# EAGLE design sd_card (EAGLE 5.12)
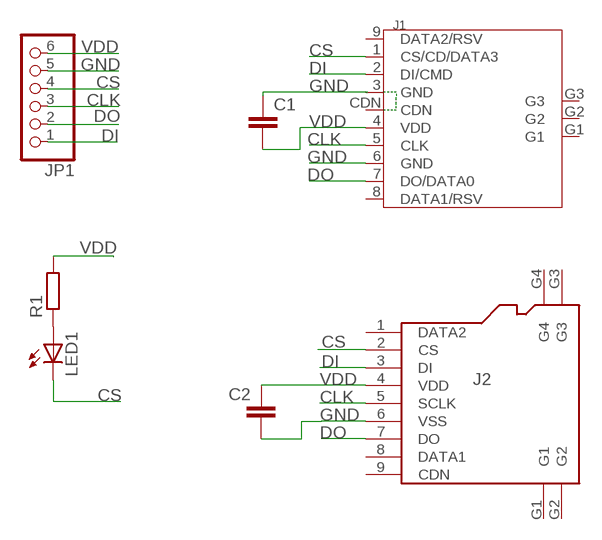
[diagram p0: schematic, sheet 1]

## Parts
C1  C-EUC0603  [C0603]
C2  C-EUC0603  [C0603]
J1  HOLDER-SD-CARD  [9P-SMD-W/O-RING]
J2  HOLDER-MICROSD-9P  [9P-SMD-W/-RING]
JP1  PINHD-1X6  [1X06]
LED1  LEDCHIP-LED0805  [CHIP-LED0805]
R1  R-EU_R0805  [R0805]

## Nets
CLK: J1.5(CLK) J2.5(SCLK) JP1.3
CS: J1.1(CS/CD/DATA3) J2.2(CS) JP1.4 LED1.C
DI: J1.2(DI/CMD) J2.3(DI) JP1.1
DO: J1.7(DO/DATA0) J2.7(DO) JP1.2
GND: C1.1 C2.2 J1.6(GND) J2.6(VSS) JP1.5
N$1: LED1.A R1.1
VDD: C1.2 C2.1 J1.4(VDD) J2.4(VDD) JP1.6 R1.2
Unconnected: J1.3(GND) J1.8(DATA1/RSV) J1.9(DATA2/RSV) J1.CDN J1.G1 J1.G2 J1.G3 J2.1(DATA2) J2.8(DATA1) J2.9(CDN) J2.G1 J2.G2 J2.G3 J2.G4

## Library data of the parts
C1 C2 = rcl:C-EU: CAPACITOR, European symbol
J1 = Connector:HOLDER-SD-CARD
J2 = Connector:HOLDER-MICROSD-9P
JP1 = pinhead:PINHD-1X6: PIN HEADER
LED1 = adafruit:LED: LED OSRAM: - CHIPLED LG R971, LG N971, LY N971, LG Q971, LY Q971, LO R971, LY R971 LH N974, LH R974 LS Q976, LO Q976, LY Q976 LO Q996 - Hyper CHIPLED LW Q18S LB Q993, LB Q99A, LB R99A - SideLED LS A670, LO A670, LY A670, LG A670, LP A670 LB A673, LV A673, LT A673, LW A673 LH A674 LY A675 LS A676, LA A676, LO A676, LY A676, LW A676 LS A679, LY A679, LG A679 - Hyper Micro SIDELED® LS Y876, LA Y876, LO Y876, LY Y876 LT Y87S - SmartLED LW L88C, LW L88S LB L89C, LB L89S, LG L890 LS L89K, LO L89K, LY L89K LS L896, LA L896, LO L896, LY L896 - TOPLED LS T670, LO T670, LY T670, LG T670, LP T670 LSG T670, LSP T670, LSY T670, LOP T670, LYG T670 LG T671, LOG T671, LSG T671 LB T673, LV T673, LT T673, LW T673 LH T674 LS T676, LA T676, LO T676, LY T676, LB T676, LH T676, LSB T676, LW T676 LB T67C, LV T67C, LT T67C, LS T67K, LO T67K, LY T67K, LW E67C LS E67B, LA E67B, LO E67B, LY E67B, LB E67C, LV E67C, LT E67C LW T67C LS T679, LY T679, LG T679 LS T770, LO T770, LY T770, LG T770, LP T770 LB T773, LV T773, LT T773, LW T773 LH T774 LS E675, LA E675, LY E675, LS T675 LS T776, LA T776, LO T776, LY T776, LB T776 LHGB T686 LT T68C, LB T68C - Hyper Mini TOPLED® LB M676 - Mini TOPLED Santana® LG M470 LS M47K, LO M47K, LY M47K Source: http://www.osram.convergy.de/
R1 = rcl:R-EU_: RESISTOR, European symbol

## Board
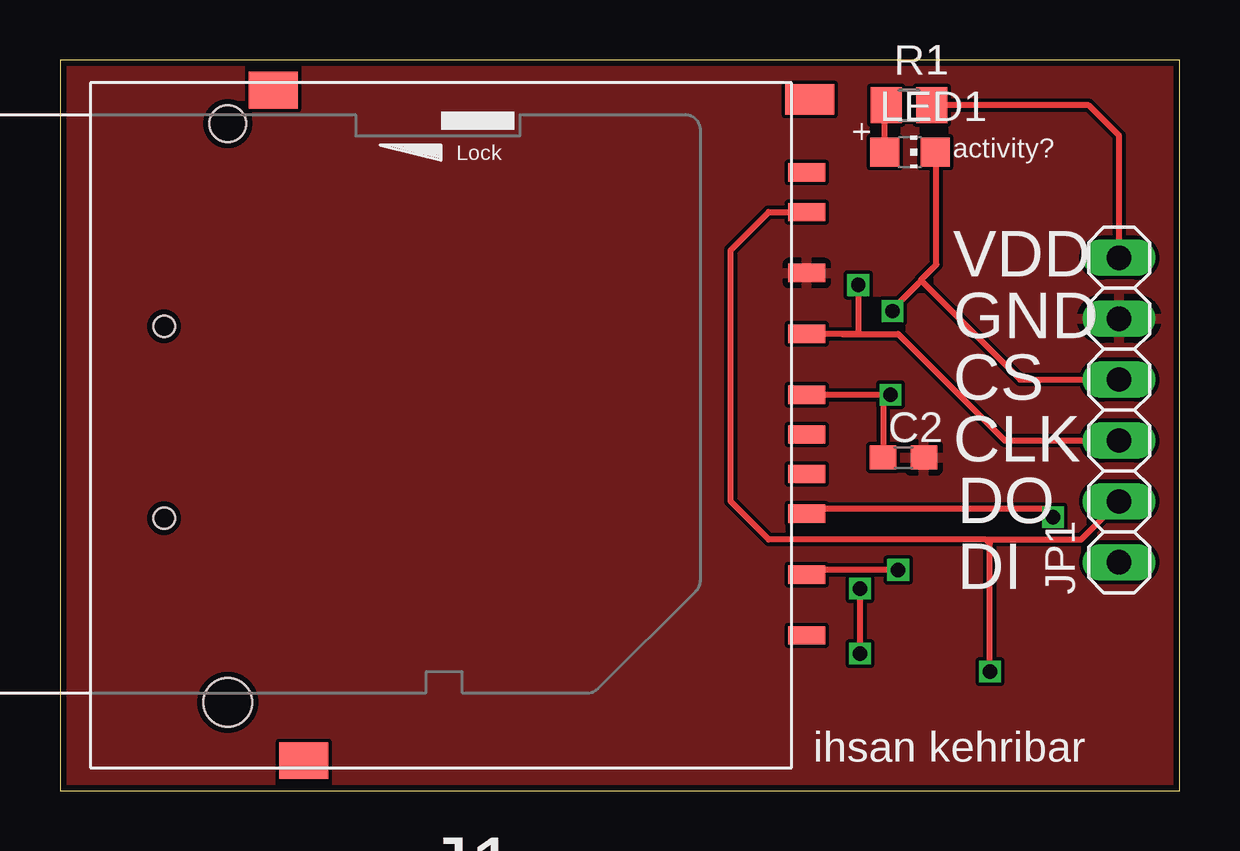
[diagram p1: board, top side]
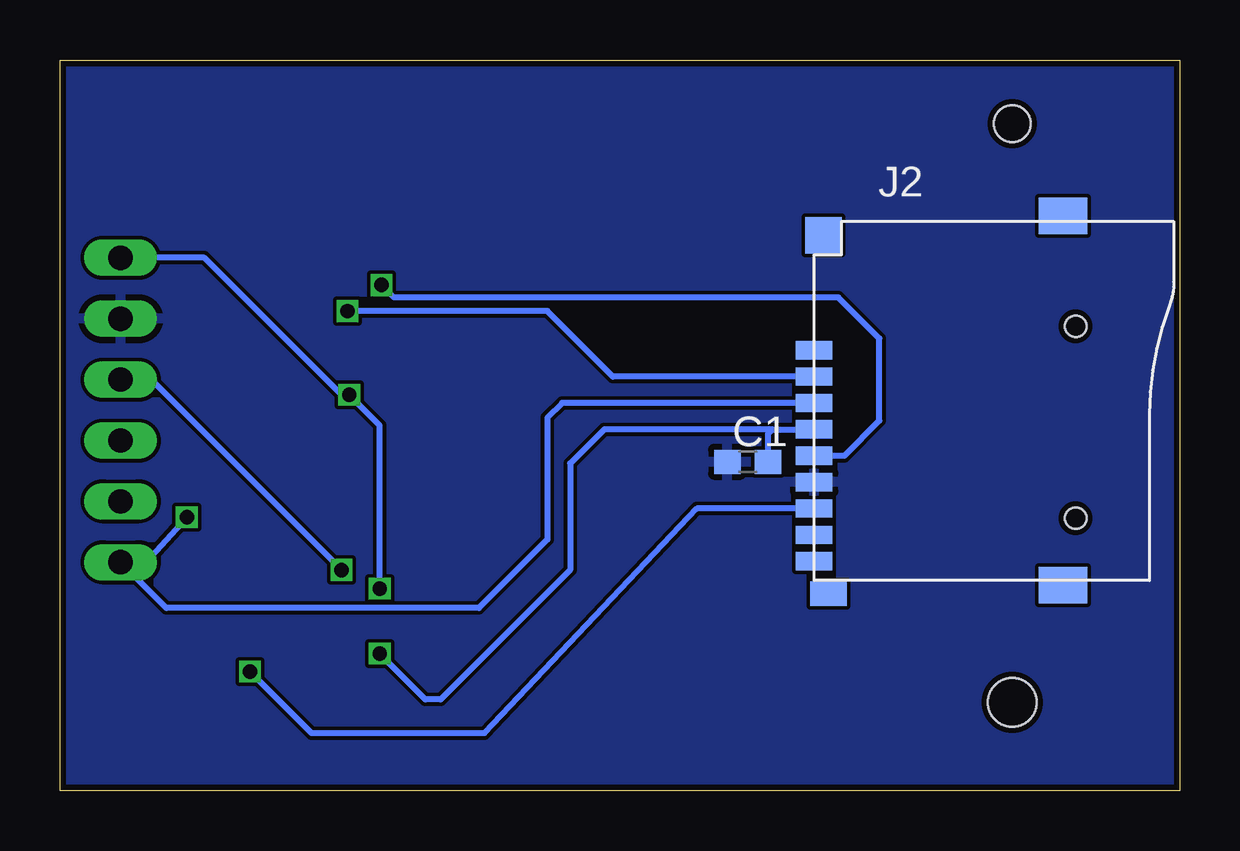
[diagram p2: board, bottom side, seen from below]

Size 46.66 x 30.47 mm. Coordinates in mm from the lower left corner, seen from the top.
Outline: 0,0 46.66,0 46.66,30.47 0,30.47 0,0
Copper layers (1*16): Top 0.035mm / dielectric 1.5mm / Bottom 0.035mm
Design rules "Fusion_eagle_rule_v1.1": minimum track width 6mil, minimum drill 12mil, track to track 6mil, track to pad 6mil, pad to pad 6mil, via to via 6mil, smd to smd 0mil, copper to edge 10mil, drill to drill 10mil, minimum pad ring 10mil, minimum via ring 6mil, stop-mask expansion 2mil, vias tented up to drill 100mil, thermal gap 10mil

### Footprints (pad centres in the part's own frame; a part is rotated, then mirrored left to right if it is on the bottom)
C0603 = smd 1.1 x 1: 1 -0.85,0; 2 0.85,0
9P-SMD-W/O-RING = smd 1.524 x 0.762: 1 -0.635,6.223; 2 -0.635,3.683; 3 -0.635,2.032; 4 -0.635,-1.27; 5 -0.635,-3.81; 6 -0.635,-6.35; 7 -0.635,-8.89; 8 -0.635,-10.541; 9 -0.635,8.763; CDN -0.635,0.381 | smd 2.032 x 1.27: G1 -0.762,-13.589 | smd 2.032 x 1.524: G2 21.59,-13.97; G3 20.32,13.97 | hole 2.032: 23.495,11.557 | hole 1.524: 23.495,-12.573
9P-SMD-W/-RING = smd 1.524 x 0.762: 1 0,4.4; 2 0,3.3; 3 0,2.2; 4 0,1.1; 5 0,0; 6 0,-1.1; 7 0,-2.2; 8 0,-3.3; 9 0,-4.4 | smd 1.524 x 1.016: G1 0.6,-5.746 | smd 2.032 x 1.524: G2 10.373,-5.4; G3 10.373,10 | smd 1.524 x 1.524: G4 0.392,9.181 | hole 0.889: 10.9,-2.6; 10.9,5.4
1X06 = drill 1.016 long: 1 -6.35,0; 2 -3.81,0; 3 -1.27,0; 4 1.27,0; 5 3.81,0; 6 6.35,0
CHIP-LED0805 = smd 1.2 x 1.2: A 0,-1.05; C 0,1.05
R0805 = smd 1.3 x 1.5: 1 -0.95,0; 2 0.95,0

### Placement (x,y rotation side)
C1  18,13.72 0 bottom
C2  35.15,13.89 0 top
J1  30.48,15.24 180 top
J2  15.24,13.97 0 bottom
JP1  44.13,15.88 90 top
LED1  35.42,26.63 270 top
R1  35.38,28.57 0 top

### Tracks (layer width: path | path; a pad name or v marks a point on that pad's centre or on a via)
CLK  (via drill 0.6)
  Top 0.254: 32.58,19.05 J1.5 | 32.58,19.05 34.92,19.05 39.37,14.61 JP1.3 | v33.26,21.09 33.26,19.05 32.58,19.05
  Bottom 0.254: J2.5 13.98,13.97 12.52,15.43 12.52,18.86 14.23,20.57 32.75,20.57 v33.26,21.09
CS  (via drill 0.6)
  Top 0.254: v34.92,9.21 31.3,9.21 J1.1 | 36.69,26.57 36.63,26.63 LED1.C 36.52,26.58 36.52,21.95 35.88,21.3 35.88,21.27 | 35.88,21.27 40.01,17.14 JP1.4 | v34.68,20 34.61,20 35.88,21.27
  Bottom 0.254: JP1.4 42.86,17.14 v34.92,9.21 | J2.2 23.62,17.27 26.35,20 v34.68,20
DI  (via drill 0.6)
  Top 0.254: J1.2 31.3,11.75 41.03,11.75 v41.38,11.4
  Bottom 0.254: v41.38,11.4 43.09,9.53 JP1.1 42.23,7.62 29.21,7.62 26.35,10.48 26.35,15.56 25.74,16.17 J2.3
DO  (via drill 0.6)
  Top 0.254: J1.7 29.53,24.13 27.94,22.54 27.94,12.06 29.53,10.48 38.58,10.48 | 38.58,10.48 42.55,10.48 JP1.2 | v38.75,4.97 38.75,10.31 38.58,10.48
  Bottom 0.254: J2.7 20.12,11.77 28.98,2.4 36.18,2.4 v38.75,4.97
GND
  pour Bottom: -5.08,-1.27 49.53,-1.27 49.53,34.29 -5.08,34.29
  pour Top: -6.35,-2.54 52.07,-2.54 52.07,35.56 -6.35,35.56
N$1
  Top 0.254: LED1.A 34.37,28.38 34.29,28.46 R1.1
VDD  (via drill 0.6)
  Top 0.254: J1.4 v34.61,16.51 34.3,16.2 C2.1 | R1.2 42.86,28.57 44.13,27.3 JP1.6 | v33.34,5.71 v33.34,8.43
  Bottom 0.254: JP1.6 40.64,22.23 34.92,16.51 v34.61,16.51 33.34,15.24 v33.34,8.43 | 16.97,15.07 J2.4 | 16.97,15.07 23.98,15.07 25.4,13.65 25.4,9.21 30.8,3.81 31.43,3.81 v33.34,5.71 | C1.2 17.15,14.89 16.97,15.07

### Text on the board
_tsilk: activity? | VDD | GND | CS | CLK | DO | DI | ihsan kehribar